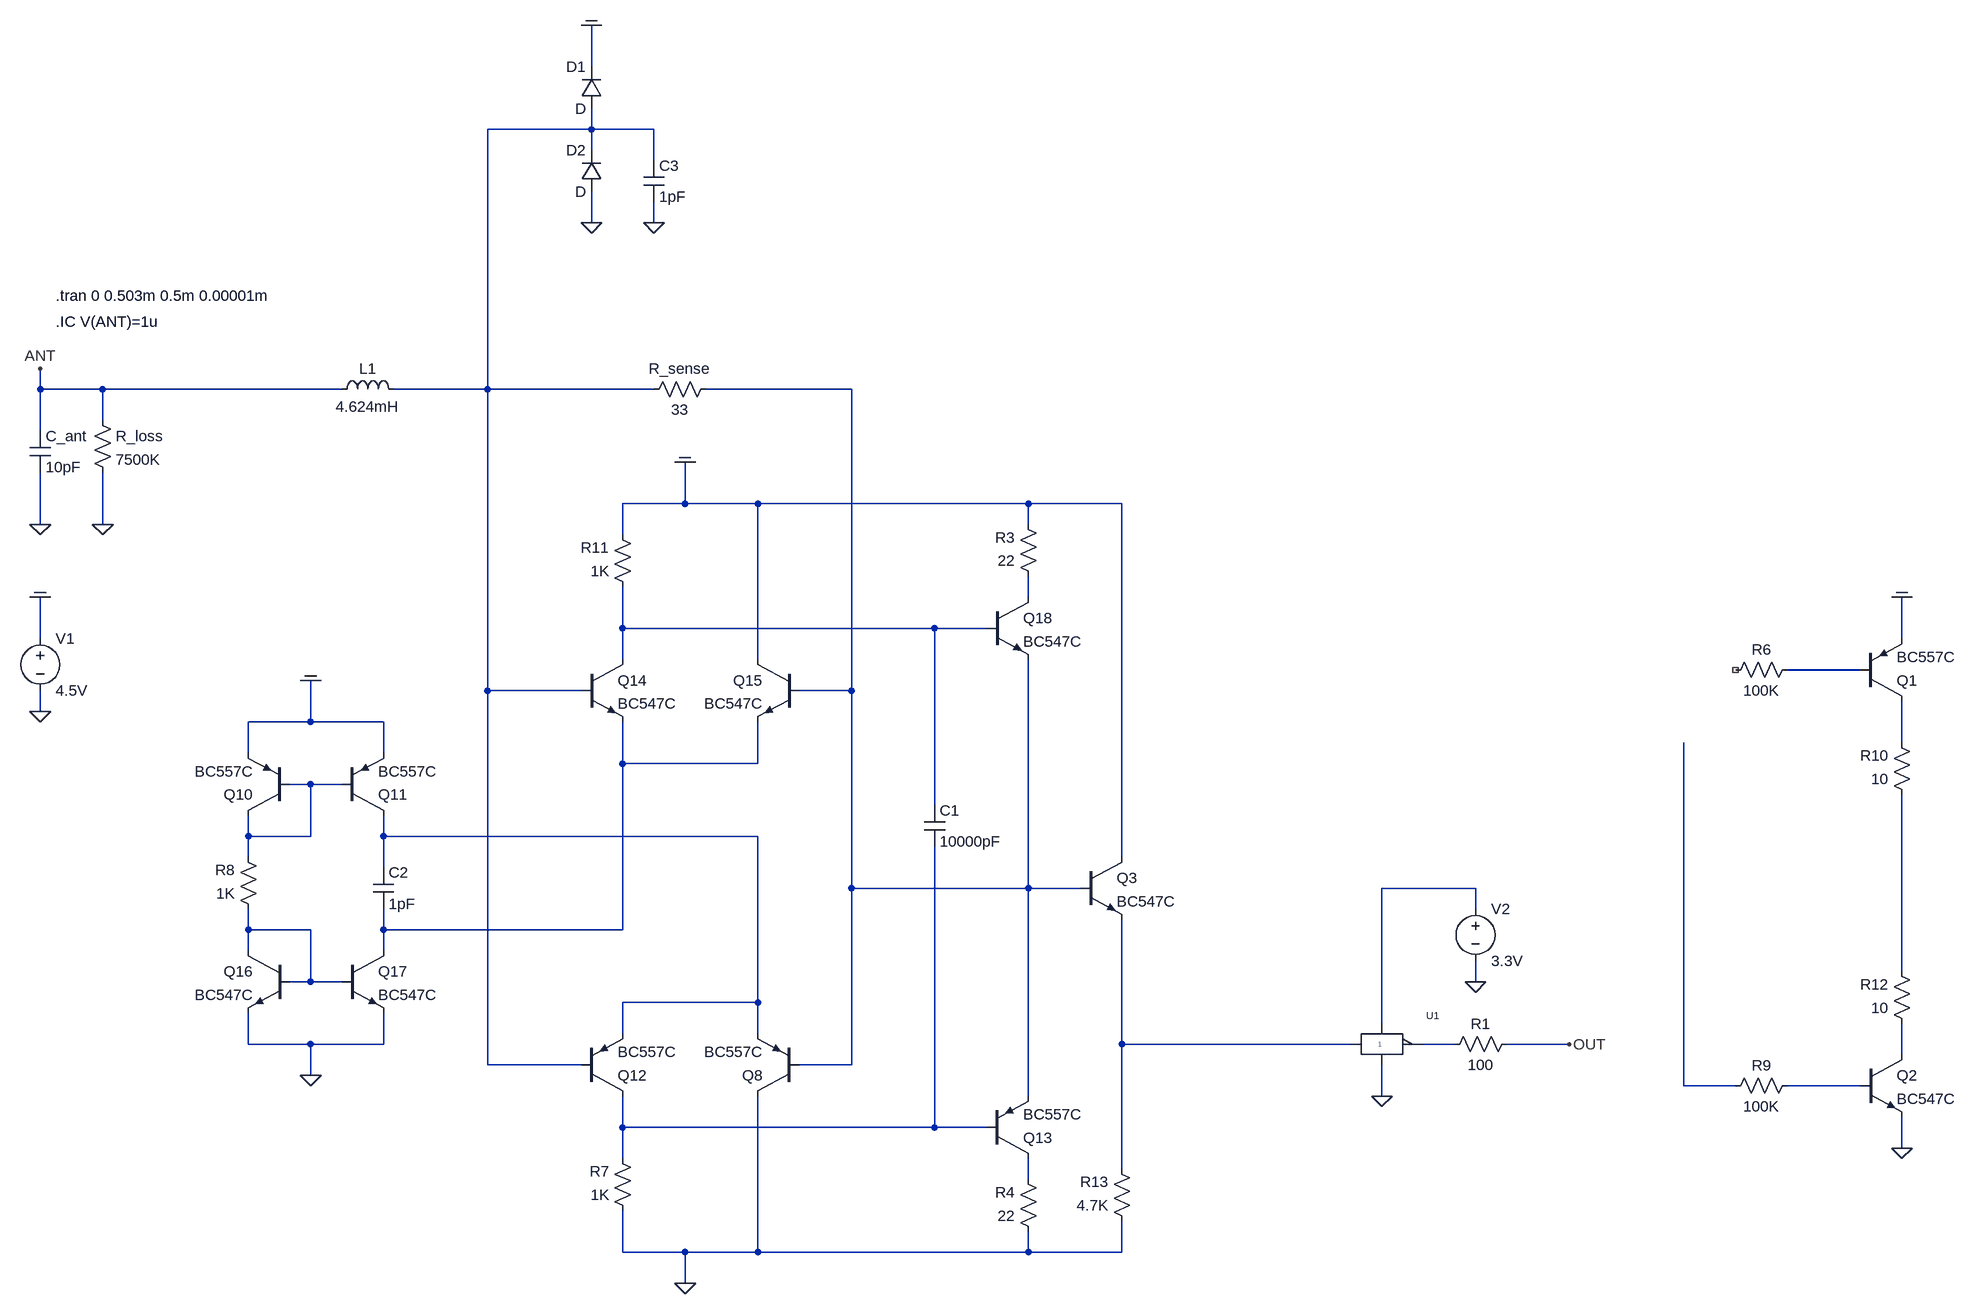
[diagram p0: schematic 2020_current_sense_npn_pnp_v03.asc]
2020_current_sense_npn_pnp_v03.asc, the LTspice schematic file:
Version 4
SHEET 1 3920 3748
WIRE 16 -16 16 -80
WIRE 16 80 16 48
WIRE 16 80 -144 80
WIRE 112 80 16 80
WIRE 16 112 16 80
WIRE 112 128 112 80
WIRE 16 224 16 176
WIRE 112 224 112 192
WIRE -832 480 -832 448
WIRE -736 480 -832 480
WIRE -368 480 -736 480
WIRE -144 480 -144 80
WIRE -144 480 -288 480
WIRE 112 480 -144 480
WIRE 416 480 192 480
WIRE -736 528 -736 480
WIRE -832 544 -832 480
WIRE 160 656 160 592
WIRE 160 656 64 656
WIRE 272 656 160 656
WIRE 688 656 272 656
WIRE 832 656 688 656
WIRE -832 688 -832 608
WIRE -736 688 -736 608
WIRE 688 688 688 656
WIRE 64 704 64 656
WIRE 688 800 688 768
WIRE 64 848 64 784
WIRE 544 848 64 848
WIRE 624 848 544 848
WIRE -832 864 -832 800
WIRE 2032 864 2032 800
WIRE 64 896 64 848
WIRE 272 896 272 656
WIRE 1968 912 1856 912
WIRE -144 944 -144 480
WIRE 0 944 -144 944
WIRE 416 944 416 480
WIRE 416 944 336 944
WIRE -832 976 -832 944
WIRE -416 992 -416 928
WIRE -416 992 -512 992
WIRE -304 992 -416 992
WIRE 2032 1024 2032 960
WIRE -512 1040 -512 992
WIRE -304 1040 -304 992
WIRE 64 1056 64 992
WIRE 272 1056 272 992
WIRE 272 1056 64 1056
WIRE -416 1088 -448 1088
WIRE -368 1088 -416 1088
WIRE 544 1120 544 848
WIRE -512 1168 -512 1136
WIRE -416 1168 -416 1088
WIRE -416 1168 -512 1168
WIRE -304 1168 -304 1136
WIRE 272 1168 -304 1168
WIRE -512 1200 -512 1168
WIRE 832 1200 832 656
WIRE -304 1216 -304 1168
WIRE 416 1248 416 944
WIRE 688 1248 688 896
WIRE 688 1248 416 1248
WIRE 768 1248 688 1248
WIRE 1376 1248 1232 1248
WIRE 1376 1280 1376 1248
WIRE -512 1312 -512 1280
WIRE -416 1312 -512 1312
WIRE -304 1312 -304 1280
WIRE 64 1312 64 1056
WIRE 64 1312 -304 1312
WIRE -512 1344 -512 1312
WIRE -304 1344 -304 1312
WIRE 2032 1376 2032 1104
WIRE -416 1392 -416 1312
WIRE -416 1392 -448 1392
WIRE -368 1392 -416 1392
WIRE 1376 1392 1376 1360
WIRE 272 1424 272 1168
WIRE 272 1424 64 1424
WIRE 1232 1456 1232 1248
WIRE 64 1472 64 1424
WIRE 272 1472 272 1424
WIRE -512 1488 -512 1440
WIRE -416 1488 -512 1488
WIRE -304 1488 -304 1440
WIRE -304 1488 -416 1488
WIRE 832 1488 832 1296
WIRE 1184 1488 832 1488
WIRE 1344 1488 1296 1488
WIRE 1520 1488 1424 1488
WIRE 2032 1504 2032 1456
WIRE -144 1520 -144 944
WIRE 0 1520 -144 1520
WIRE 416 1520 416 1248
WIRE 416 1520 336 1520
WIRE -416 1536 -416 1488
WIRE 1696 1552 1696 1024
WIRE 1776 1552 1696 1552
WIRE 1968 1552 1856 1552
WIRE 688 1568 688 1248
WIRE 1232 1568 1232 1520
WIRE 64 1616 64 1568
WIRE 544 1616 544 1184
WIRE 544 1616 64 1616
WIRE 624 1616 544 1616
WIRE 2032 1648 2032 1600
WIRE 64 1664 64 1616
WIRE 832 1680 832 1488
WIRE 688 1696 688 1664
WIRE 64 1808 64 1744
WIRE 160 1808 64 1808
WIRE 272 1808 272 1568
WIRE 272 1808 160 1808
WIRE 688 1808 688 1776
WIRE 688 1808 272 1808
WIRE 832 1808 832 1760
WIRE 832 1808 688 1808
WIRE 160 1856 160 1808
FLAG -832 976 0
FLAG -832 800 COM
FLAG -832 688 0
FLAG -832 448 ANT
FLAG -736 688 0
FLAG 160 1856 0
FLAG -416 928 COM
FLAG -416 1536 0
FLAG 160 592 COM
FLAG 1520 1488 OUT
FLAG 1232 1568 0
FLAG 1376 1392 0
FLAG 2032 1648 0
FLAG 2032 800 COM
FLAG 16 224 0
FLAG 16 -80 COM
FLAG 112 224 0
SYMBOL voltage -832 848 R0
WINDOW 123 0 0 Left 0
WINDOW 39 0 0 Left 0
SYMATTR InstName V1
SYMATTR Value 4.5V
SYMBOL ind -384 496 R270
WINDOW 0 32 56 VTop 2
WINDOW 3 5 56 VBottom 2
SYMATTR InstName L1
SYMATTR Value 4.624mH
SYMATTR SpiceLine Rser=120 Rpar=100Meg Cpar=1.216pF
SYMBOL cap -848 544 R0
SYMATTR InstName C_ant
SYMATTR Value 10pF
SYMBOL res -752 512 R0
SYMATTR InstName R_loss
SYMATTR Value 7500K
SYMBOL res 208 464 R90
WINDOW 0 0 56 VBottom 2
WINDOW 3 32 56 VTop 2
SYMATTR InstName R_sense
SYMATTR Value 33
SYMBOL pnp 336 1568 R180
SYMATTR InstName Q8
SYMATTR Value BC557C
SYMBOL pnp -448 1136 R180
SYMATTR InstName Q10
SYMATTR Value BC557C
SYMBOL pnp -368 1136 M180
SYMATTR InstName Q11
SYMATTR Value BC557C
SYMBOL pnp 0 1568 M180
SYMATTR InstName Q12
SYMATTR Value BC557C
SYMBOL res 80 1760 R180
WINDOW 0 36 76 Left 2
WINDOW 3 36 40 Left 2
SYMATTR InstName R7
SYMATTR Value 1K
SYMBOL res -496 1296 R180
WINDOW 0 36 76 Left 2
WINDOW 3 36 40 Left 2
SYMATTR InstName R8
SYMATTR Value 1K
SYMBOL pnp 624 1664 M180
SYMATTR InstName Q13
SYMATTR Value BC557C
SYMBOL npn 0 896 R0
SYMATTR InstName Q14
SYMATTR Value BC547C
SYMBOL npn 336 896 M0
SYMATTR InstName Q15
SYMATTR Value BC547C
SYMBOL npn -448 1344 M0
SYMATTR InstName Q16
SYMATTR Value BC547C
SYMBOL npn -368 1344 R0
SYMATTR InstName Q17
SYMATTR Value BC547C
SYMBOL res 80 800 R180
WINDOW 0 36 76 Left 2
WINDOW 3 36 40 Left 2
SYMATTR InstName R11
SYMATTR Value 1K
SYMBOL npn 624 800 R0
SYMATTR InstName Q18
SYMATTR Value BC547C
SYMBOL res 704 784 R180
WINDOW 0 36 76 Left 2
WINDOW 3 36 40 Left 2
SYMATTR InstName R3
SYMATTR Value 22
SYMBOL res 704 1792 R180
WINDOW 0 36 76 Left 2
WINDOW 3 36 40 Left 2
SYMATTR InstName R4
SYMATTR Value 22
SYMBOL 74AHC1G04 1232 1440 R0
SYMATTR InstName U1
SYMBOL res 1328 1504 R270
WINDOW 0 32 56 VTop 2
WINDOW 3 0 56 VBottom 2
SYMATTR InstName R1
SYMATTR Value 100
SYMBOL cap 528 1120 R0
SYMATTR InstName C1
SYMATTR Value 10000pF
SYMBOL voltage 1376 1264 R0
WINDOW 123 0 0 Left 0
WINDOW 39 0 0 Left 0
SYMATTR InstName V2
SYMATTR Value 3.3V
SYMBOL pnp 1968 960 M180
SYMATTR InstName Q1
SYMATTR Value BC557C
SYMBOL npn 1968 1504 R0
SYMATTR InstName Q2
SYMATTR Value BC547C
SYMBOL res 1760 928 R270
WINDOW 0 32 56 VTop 2
WINDOW 3 0 56 VBottom 2
SYMATTR InstName R6
SYMATTR Value 100K
SYMBOL res 1760 1568 R270
WINDOW 0 32 56 VTop 2
WINDOW 3 0 56 VBottom 2
SYMATTR InstName R9
SYMATTR Value 100K
SYMBOL res 2048 1120 R180
WINDOW 0 36 76 Left 2
WINDOW 3 36 40 Left 2
SYMATTR InstName R10
SYMATTR Value 10
SYMBOL res 2048 1472 R180
WINDOW 0 36 76 Left 2
WINDOW 3 36 40 Left 2
SYMATTR InstName R12
SYMATTR Value 10
SYMBOL npn 768 1200 R0
SYMATTR InstName Q3
SYMATTR Value BC547C
SYMBOL res 848 1776 R180
WINDOW 0 36 76 Left 2
WINDOW 3 36 40 Left 2
SYMATTR InstName R13
SYMATTR Value 4.7K
SYMBOL cap -320 1216 R0
SYMATTR InstName C2
SYMATTR Value 1pF
SYMBOL diode 32 48 R180
WINDOW 0 24 64 Left 2
WINDOW 3 24 0 Left 2
SYMATTR InstName D1
SYMBOL diode 32 176 R180
WINDOW 0 24 64 Left 2
WINDOW 3 24 0 Left 2
SYMATTR InstName D2
SYMBOL cap 96 128 R0
SYMATTR InstName C3
SYMATTR Value 1pF
TEXT -808 336 Left 2 !.tran 0 0.503m 0.5m 0.00001m
TEXT -808 376 Left 2 !.IC V(ANT)=1u

The netlist it stands for:
* 2020_current_sense_npn_pnp_v03.asc
V1 COM 0 4.5V
L1 ANT N001 4.624mH Rser=120 Rpar=100Meg Cpar=1.216pF
C_ant ANT 0 10pF
R_loss ANT 0 7500K
R_sense N002 N001 33
Q8 0 N002 N009 0 BC557C
Q10 N008 N008 COM 0 BC557C
Q11 N009 N008 COM 0 BC557C
Q12 N018 N001 N009 0 BC557C
R7 0 N018 1K
R8 N011 N008 1K
Q13 N019 N018 N002 0 BC557C
Q14 N004 N001 N007 0 BC547C
Q15 COM N002 N007 0 BC547C
Q16 N011 N011 0 0 BC547C
Q17 N007 N011 0 0 BC547C
R11 N004 COM 1K
Q18 N003 N004 N002 0 BC547C
R3 N003 COM 22
R4 0 N019 22
XU1 N013 N014 N010 0 74AHC1G04  ; pins in out vcc gnd
R1 N014 OUT 100
C1 N004 N018 10000pF
V2 N010 0 3.3V
Q1 N006 N005 COM 0 BC557C
Q2 N015 N017 0 0 BC547C
R6 NC_01 N005 100K
R9 N016 N017 100K
R10 N012 N006 10
R12 N015 N012 10
Q3 COM N002 N013 0 BC547C
R13 0 N013 4.7K
C2 N009 N007 1pF
D1 N001 COM D
D2 0 N001 D
C3 N001 0 1pF
.model D D
.lib standard.dio
.model NPN NPN
.model PNP PNP
.lib standard.bjt
.tran 0 0.503m 0.5m 0.00001m
.IC V(ANT)=1u
.lib 74AHC1G04.cir
.backanno
.end